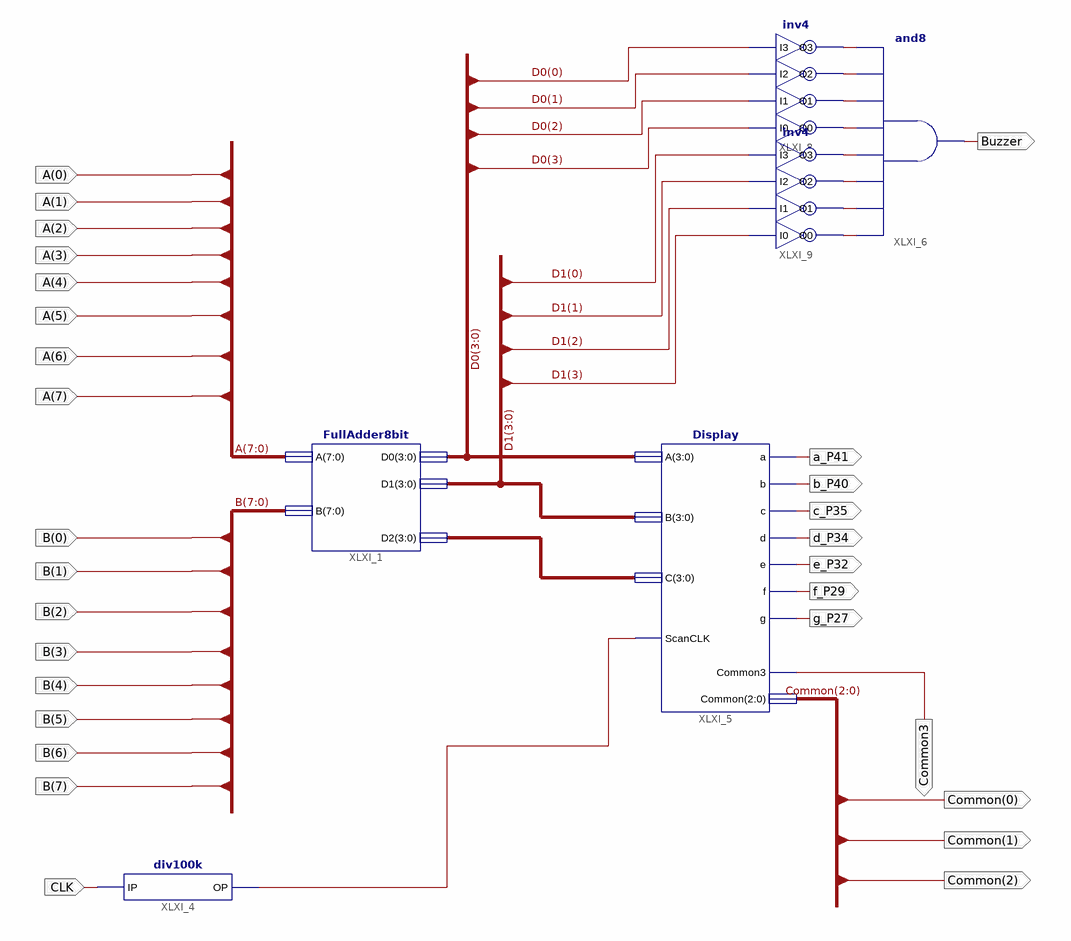
[diagram p0: schematic sheet 1]
// Xilinx ISE schematic Lab8.sch (spartan6) as structural Verilog: 6 symbols, 29 ports
module Lab8 (
  input  CLK,
  input  [7:0] A,
  input  [7:0] B,
  output a_P41,
  output b_P40,
  output c_P35,
  output d_P34,
  output e_P32,
  output f_P29,
  output g_P27,
  output Common3,
  output [2:0] Common,
  output Buzzer
);

  wire XLXN_12, XLXN_13, XLXN_14, XLXN_15, XLXN_16, XLXN_17, XLXN_18, XLXN_19, XLXN_20;
  wire [3:0] D0, D1, XLXN_5;

  FullAdder8bit XLXI_1 (.A(A), .B(B), .D0(D0), .D1(D1), .D2(XLXN_5));
  div100k XLXI_4 (.IP(CLK), .OP(XLXN_12));
  Display XLXI_5 (
    .A(D0), .B(D1), .C(XLXN_5), .ScanCLK(XLXN_12), .a(a_P41), .b(b_P40), .c(c_P35), .d(d_P34), .e(e_P32),
    .f(f_P29), .g(g_P27), .Common3(Common3), .Common(Common));
  inv4 XLXI_8 (.I0(D0[3]), .I1(D0[2]), .I2(D0[1]), .I3(D0[0]), .O0(XLXN_13), .O1(XLXN_14), .O2(XLXN_15), .O3(XLXN_16));
  inv4 XLXI_9 (.I0(D1[3]), .I1(D1[2]), .I2(D1[1]), .I3(D1[0]), .O0(XLXN_17), .O1(XLXN_18), .O2(XLXN_19), .O3(XLXN_20));
  and XLXI_6 (Buzzer, XLXN_17, XLXN_18, XLXN_19, XLXN_20, XLXN_13, XLXN_14, XLXN_15, XLXN_16);
endmodule
